# EAGLE design uino-mx250 (EAGLE 7.7.0)
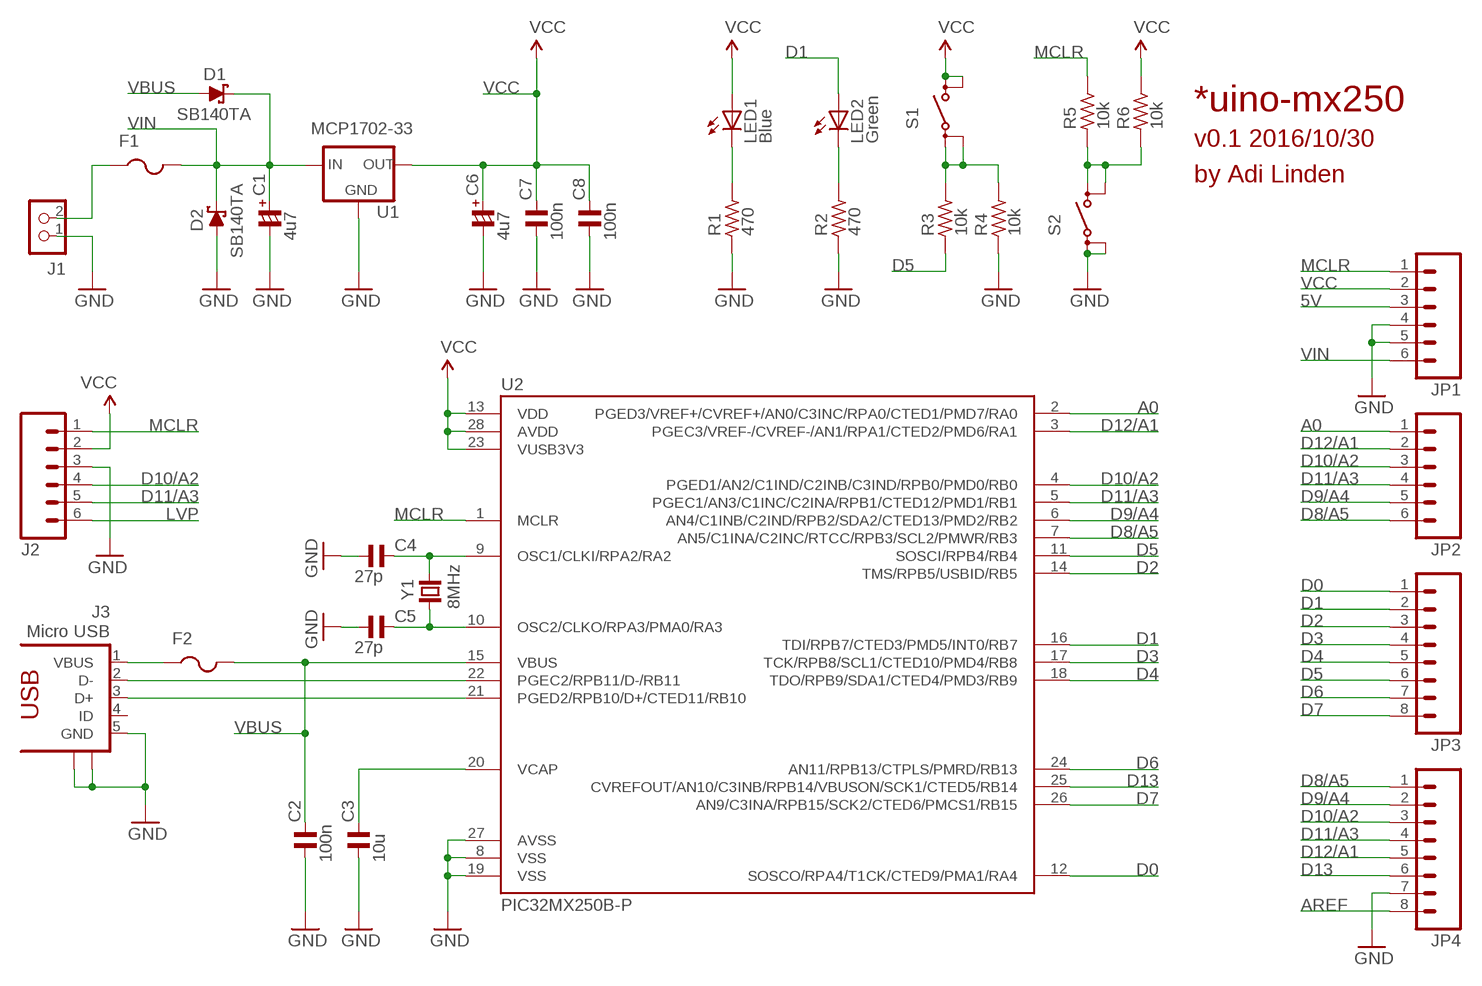
[diagram p0: schematic, sheet 1]

## Parts
C1  4u7  CP_TT025-040  [CTT-025-040]
C2  100n  C_C025-040X018  [C025-040X018]
C3  10u  C_C025-040X018  [C025-040X018]
C4  27p  C_C025-040X018  [C025-040X018]
C5  27p  C_C025-040X018  [C025-040X018]
C6  4u7  CP_TT025-040  [CTT-025-040]
C7  100n  C_C025-040X018  [C025-040X018]
C8  100n  C_C025-040X018  [C025-040X018]
D1  SB140TA  SCHOTTKY-DIODEDO35-7  [DO35-7]
D2  SB140TA  SCHOTTKY-DIODEDO35-7  [DO35-7]
F1  FUSE_PTC-TH  [PTC]
F2  FUSE_PTC-TH  [PTC]
J1  CON_TERMINAL_BLOCK_02-5MM  [TERMINAL_BLOCK_2P_5]
J2  M06LOCK  [1X06_LOCK]
J3  Micro USB  USB_MICRO_B_2.0-TH  [ZX62D-AB-5P8]
JP1  M06SIP  [1X06]
JP2  M06SIP  [1X06]
JP3  M081X08  [1X08]
JP4  M081X08  [1X08]
LED1  Blue  LED3MM  [LED3MM]
LED2  Green  LED3MM  [LED3MM]
R1  470  R_X0207/7  [0207/7]
R2  470  R_X0207/7  [0207/7]
R3  10k  R_X0207/7  [0207/7]
R4  10k  R_X0207/7  [0207/7]
R5  10k  R_X0207/7  [0207/7]
R6  10k  R_X0207/7  [0207/7]
S1  TL1100X  [TL1100X]
S2  TL1100X  [TL1100X]
U1  MCP1702-33  V_REG_MCP170X  [TO-92]
U2  PIC32MX250B-P  [DIL28-3]
Y1  8MHz  CRYTALHC49S  [HC49/S]

## Nets
5V: JP1.3
A0: JP2.1 U2.2(PGED3/VREF+/CVREF+/AN0/C3INC/RPA0/CTED1/PMD7/RA0)
AREF: JP4.8
D0: JP3.1 U2.12(SOSCO/RPA4/T1CK/CTED9/PMA1/RA4)
D1: JP3.2 LED2.A U2.16(TDI/RPB7/CTED3/PMD5/INT0/RB7)
D2: JP3.3 U2.14(TMS/RPB5/USBID/RB5)
D3: JP3.4 U2.17(TCK/RPB8/SCL1/CTED10/PMD4/RB8)
D4: JP3.5 U2.18(TDO/RPB9/SDA1/CTED4/PMD3/RB9)
D5: JP3.6 R3.1 U2.11(SOSCI/RPB4/RB4)
D6: JP3.7 U2.24(AN11/RPB13/CTPLS/PMRD/RB13)
D7: JP3.8 U2.26(AN9/C3INA/RPB15/SCK2/CTED6/PMCS1/RB15)
D8/A5: JP2.6 JP4.1 U2.7(AN5/C1INA/C2INC/RTCC/RPB3/SCL2/PMWR/RB3)
D9/A4: JP2.5 JP4.2 U2.6(AN4/C1INB/C2IND/RPB2/SDA2/CTED13/PMD2/RB2)
D10/A2: J2.4 JP2.3 JP4.3 U2.4(PGED1/AN2/C1IND/C2INB/C3IND/RPB0/PMD0/RB0)
D11/A3: J2.5 JP2.4 JP4.4 U2.5(PGEC1/AN3/C1INC/C2INA/RPB1/CTED12/PMD1/RB1)
D12/A1: JP2.2 JP4.5 U2.3(PGEC3/VREF-/CVREF-/AN1/RPA1/CTED2/PMD6/RA1)
D13: JP4.6 U2.25(CVREFOUT/AN10/C3INB/RPB14/VBUSON/SCK1/CTED5/RB14)
GND: C1.- C2.1 C3.1 C4.1 C5.1 C6.- C7.1 C8.1 D2.A J1.1 J2.3 J3.5(GND) J3.S1 J3.S2 JP1.4 JP1.5 JP4.7 R1.1 R2.1 R4.1 S2.1(P) S2.2(P1) U1.1(GND) U2.8(VSS) U2.19(VSS) U2.27(AVSS)
LVP: J2.6
MCLR: J2.1 JP1.1 R5.2 U2.1(MCLR)
N$2: F1.P$1 J1.2
N$4: F2.P$1 J3.1(VBUS)
N$5: LED1.K(C) R1.2
N$6: LED2.K(C) R2.2
N$8: R3.2 R4.2 S1.1(P) S1.2(P1)
N$10: R5.1 R6.1 S2.3(S) S2.4(S1)
N$13: C3.2 U2.20(VCAP)
N$15: J3.2(D-) U2.22(PGEC2/RPB11/D-/RB11)
N$16: J3.3(D+) U2.21(PGED2/RPB10/D+/CTED11/RB10)
N$24: C4.2 U2.9(OSC1/CLKI/RPA2/RA2) Y1.2
N$25: C5.2 U2.10(OSC2/CLKO/RPA3/PMA0/RA3) Y1.1
VBUS: C2.2 D1.A F2.P$2 U2.15(VBUS)
VCC: C6.+ C7.2 C8.2 J2.2 JP1.2 LED1.A R6.2 S1.3(S) S1.4(S1) U1.3(OUT) U2.13(VDD) U2.23(VUSB3V3) U2.28(AVDD)
VIN: C1.+ D1.C D2.C F1.P$2 JP1.6 U1.2(IN)
Unconnected: J3.4(ID)

## Notes on the sheet
- *uino-mx250
- v0.1 2016/10/30
- by Adi Linden

## Library data of the parts
C1 C6 = rc-master:CP_: POLARIZED CAP
C2-C5 C7 C8 = rc-master:C_: NON-POLARIZED CAP
D1 D2 = diode:SCHOTTKY-DIODE: Schottky Diode
F1 F2 = adi-misc:FUSE_PTC: PTC fuses, resettable thermistors
J1 = adi-misc:CON_TERMINAL_BLOCK_02: 2 poles wire to board terminal block
J2 = SparkFun-Connectors:M06: Header 6 Standard 6-pin 0.1" header. Use with straight break away headers (SKU : PRT-00116), right angle break away headers (PRT-00553), swiss pins (PRT-00743), machine pins (PRT-00117), and female headers (PRT-00115). Molex polarized connector foot print use with SKU : PRT-08094 with associated ...
J3 = adi-misc:USB_MICRO_B_2.0-TH: USB Micro AB OTG Receptacle Hirose ZX62D-AB-5P8 Amphenol FCI 10118194-0001LF
JP1 JP2 = SparkFun:M06: Header 6 Standard 6-pin 0.1" header. Use with straight break away headers (SKU : PRT-00116), right angle break away headers (PRT-00553), swiss pins (PRT-00743), machine pins (PRT-00117), and female headers (PRT-00115). Molex polarized connector foot print use with SKU : PRT-08094 with associated ...
JP3 JP4 = SparkFun:M08: Header 8 Standard 8-pin 0.1" header. Use with straight break away headers (SKU : PRT-00116), right angle break away headers (PRT-00553), swiss pins (PRT-00743), machine pins (PRT-00117), and female headers (PRT-00115).
LED1 LED2 = led:LED: LED OSRAM: - CHIPLED LG R971, LG N971, LY N971, LG Q971, LY Q971, LO R971, LY R971 LH N974, LH R974 LS Q976, LO Q976, LY Q976 LO Q996 - Hyper CHIPLED LW Q18S LB Q993, LB Q99A, LB R99A - SideLED LS A670, LO A670, LY A670, LG A670, LP A670 LB A673, LV A673, LT A673, LW A673 LH A674 LY A675 LS A676, LA A676, LO A676, LY A676, LW A676 LS A679, LY A679, LG A679 - Hyper Micro SIDELED® LS Y876, LA Y876, LO Y876, LY Y876 LT Y87S - SmartLED LW L88C, LW L88S LB L89C, LB L89S, LG L890 LS L89K, LO L89K, LY L89K LS L896, LA L896, LO L896, LY L896 - TOPLED LS T670, LO T670, LY T670, LG T670, LP T670 LSG T670, LSP T670, LSY T670, LOP T670, LYG T670 LG T671, LOG T671, LSG T671 LB T673, LV T673, LT T673, LW T673 LH T674 LS T676, LA T676, LO T676, LY T676, LB T676, LH T676, LSB T676, LW T676 LB T67C, LV T67C, LT T67C, LS T67K, LO T67K, LY T67K, LW E67C LS E67B, LA E67B, LO E67B, LY E67B, LB E67C, LV E67C, LT E67C LW T67C LS T679, LY T679, LG T679 LS T770, LO T770, LY T770, LG T770, LP T770 LB T773, LV T773, LT T773, LW T773 LH T774 LS E675, LA E675, LY E675, LS T675 LS T776, LA T776, LO T776, LY T776, LB T776 LHGB T686 LT T68C, LB T68C - Hyper Mini TOPLED® LB M676 - Mini TOPLED Santana® LG M470 LS M47K, LO M47K, LY M47K Source: http://www.osram.convergy.de LUXEON: - LUMILED® LXK2-PW12-R00, LXK2-PW12-S00, LXK2-PW14-U00, LXK2-PW14-V00 LXK2-PM12-R00, LXK2-PM12-S00, LXK2-PM14-U00 LXK2-PE12-Q00, LXK2-PE12-R00, LXK2-PE12-S00, LXK2-PE14-T00, LXK2-PE14-U00 LXK2-PB12-K00, LXK2-PB12-L00, LXK2-PB12-M00, LXK2-PB14-N00, LXK2-PB14-P00, LXK2-PB14-Q00 LXK2-PR12-L00, LXK2-PR12-M00, LXK2-PR14-Q00, LXK2-PR14-R00 LXK2-PD12-Q00, LXK2-PD12-R00, LXK2-PD12-S00 LXK2-PH12-R00, LXK2-PH12-S00 LXK2-PL12-P00, LXK2-PL12-Q00, LXK2-PL12-R00 Source: www.luxeon.com KINGBRIGHT: KA-3528ASYC Source: www.kingbright.com
R1-R6 = rc-master:R_: RESISTOR
S1 S2 = adi-misc:TL1100X: TACTILE SWITCH
U1 = adi-misc:V_REG_MCP170X
U2 = adi-pic:PIC32MX250B
Y1 = crystal:CRYTAL: CRYSTAL

## Board
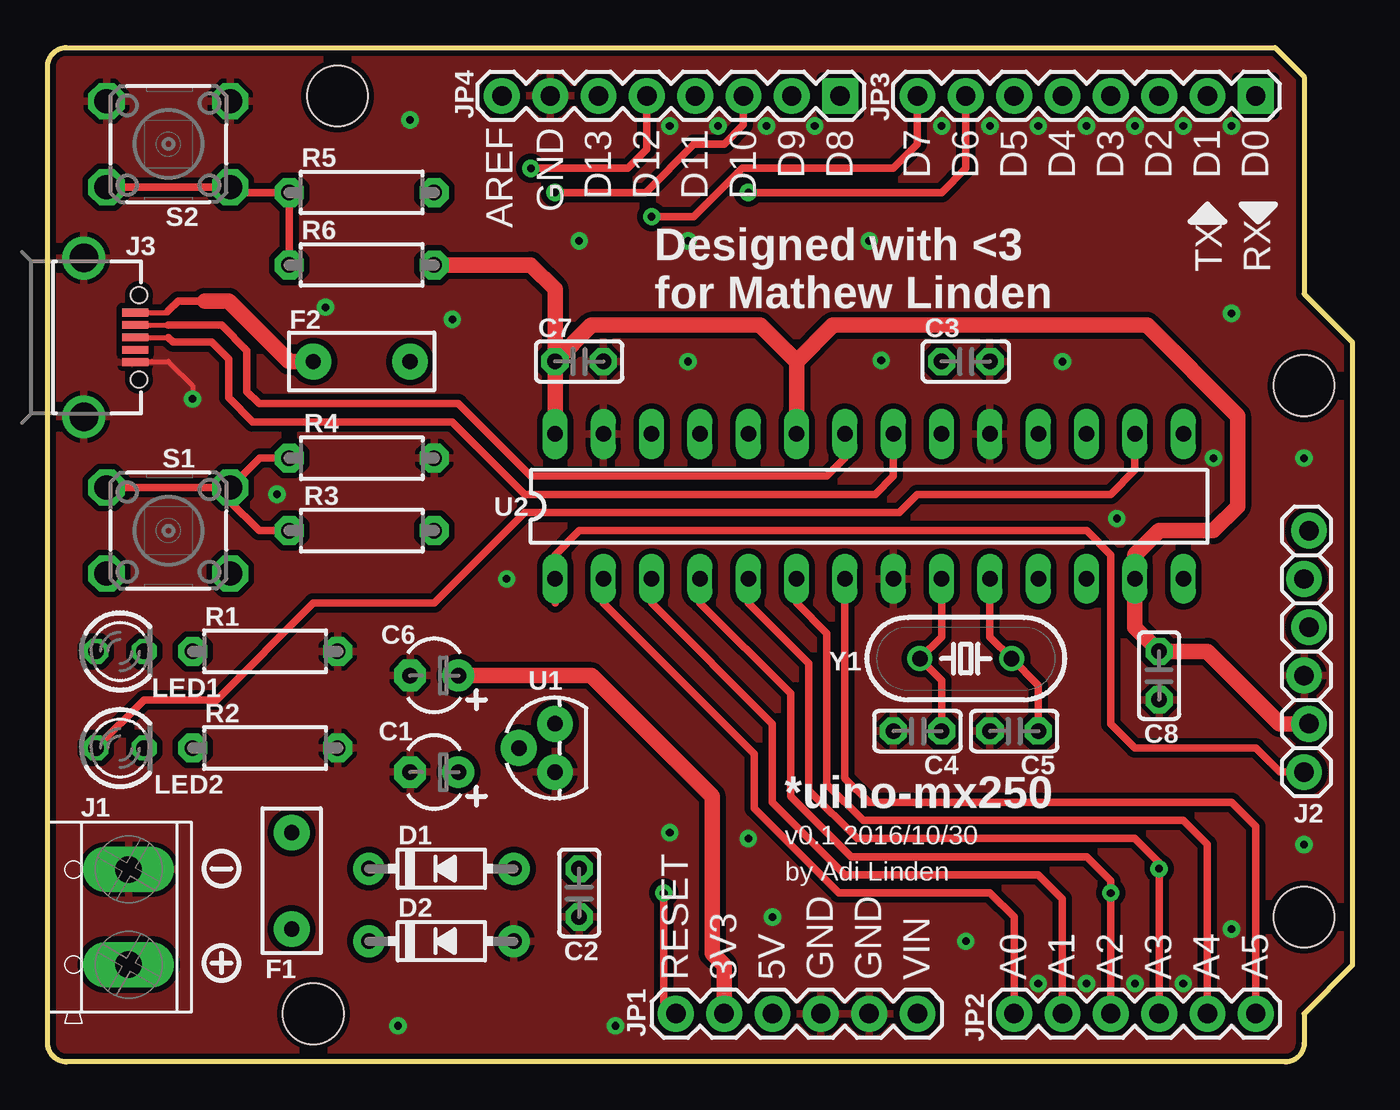
[diagram p1: board, top side]
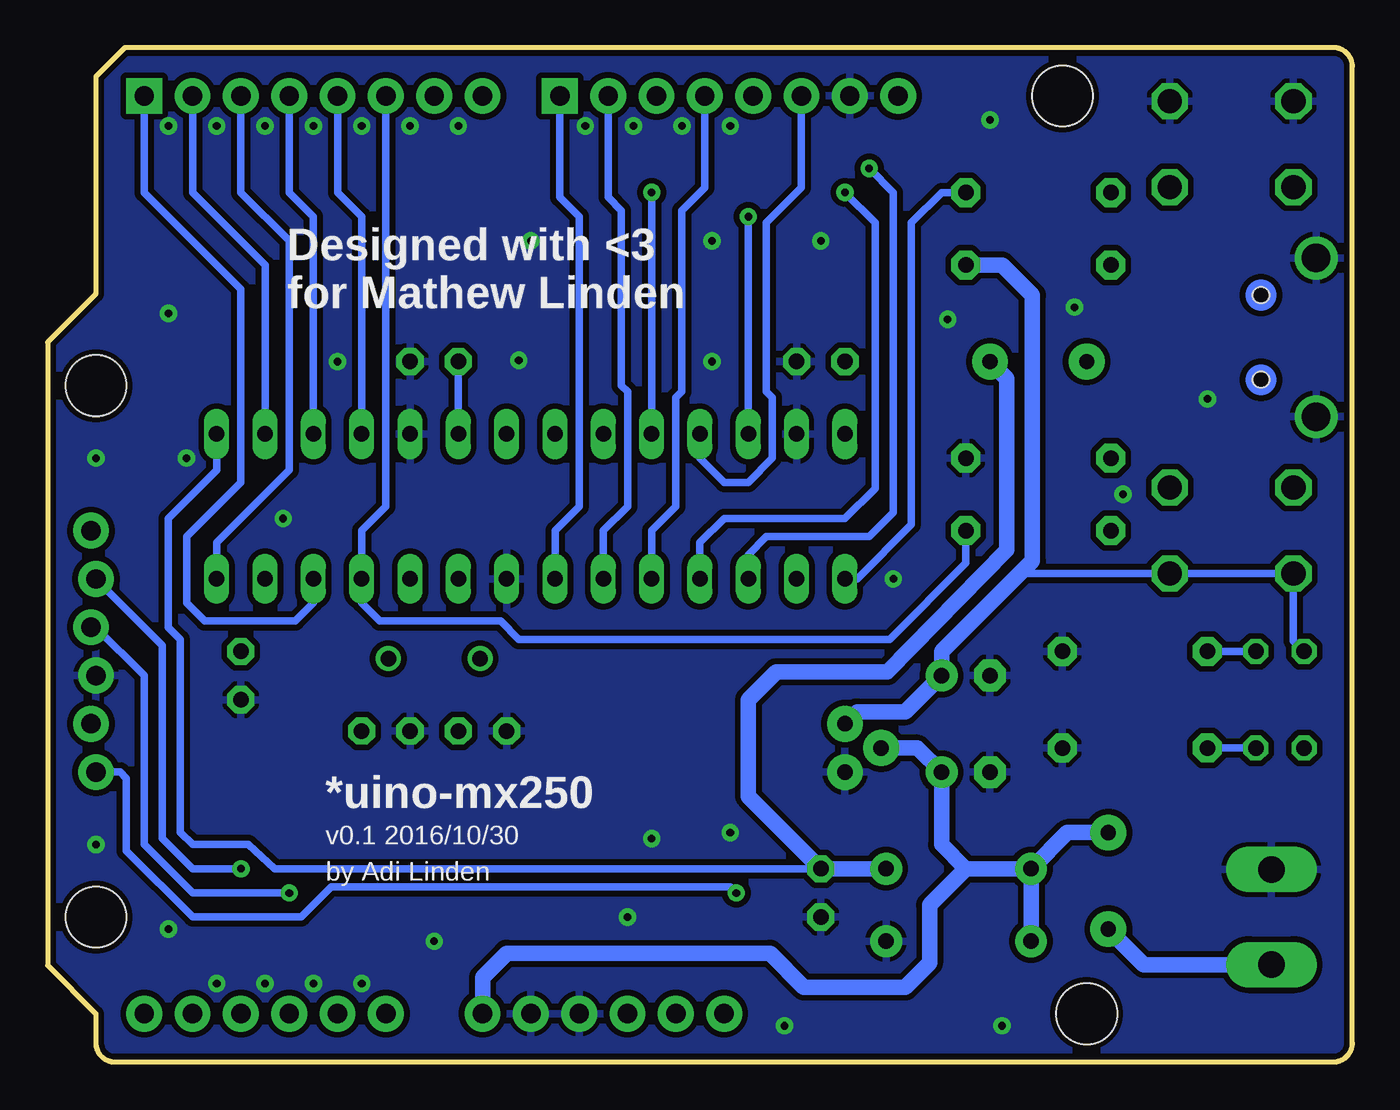
[diagram p2: board, bottom side, seen from below]

Size 68.58 x 53.34 mm. Coordinates in mm from the lower left corner, seen from the top.
Outline: 64.52,53.34 66.04,51.82 66.04,40.39 68.58,37.85 68.58,5.08 66.04,2.54 66.04,1 arc-90 65.04,0 1,0 arc-90 0,1 0,52.34 arc-90 1,53.34 64.52,53.34
Copper layers (1*16): Top 0.035mm / dielectric 1.5mm / Bottom 0.035mm
Design rules "SeeedStudio_2layer_DRU_no_angle_20140221 *": minimum track width 6mil, minimum drill 12mil, track to track 6mil, track to pad 6mil, pad to pad 6mil, via to via 6mil, smd to smd 0mil, copper to edge 10mil, drill to drill 10mil, minimum pad ring 10mil, minimum via ring 10mil, stop-mask expansion 2mil, vias tented up to drill 25mil, thermal gap 10mil
Holes 3.2 mm at 66.04,35.56 66.04,7.62 15.24,50.8 13.97,2.54

### Footprints (pad centres in the part's own frame; a part is rotated, then mirrored left to right if it is on the bottom)
CTT-025-040 = drill 0.813 pad 1.676: + -1.27,0 | drill 0.813 pad 1.676 octagon: - 1.27,0
C025-040X018 = drill 0.813 pad 1.422 octagon: 1 -1.27,0; 2 1.27,0
DO35-7 = drill 0.813 pad 1.676: A 3.81,0; C -3.81,0
PTC = drill 0.8 pad 1.88: P$1 -2.54,0; P$2 2.54,0
TERMINAL_BLOCK_2P_5 = drill 1.4 pad 2.38 long: 1 2.5,-0.45; 2 -2.5,-0.45
1X06_LOCK = drill 1.016 pad 1.88: 1 0,0; 2 2.54,-0.254; 3 5.08,0; 4 7.62,-0.254; 5 10.16,0; 6 12.7,-0.254
ZX62D-AB-5P8 = smd 0.4 x 1.35: 1 -1.3,2.7; 2 -0.65,2.7; 3 0,2.7; 4 0.65,2.7; 5 1.3,2.7 | drill 1.5: S1 -4.175,0; S2 4.175,0 | hole 0.85: -2.225,2.9; 2.225,2.9
1X06 = drill 1.016 pad 1.88: 1 0,0; 2 2.54,0; 3 5.08,0; 4 7.62,0; 5 10.16,0; 6 12.7,0
1X08 = drill 1.016 pad 1.88 square: 1 0,0 | drill 1.016 pad 1.88: 2 2.54,0; 3 5.08,0; 4 7.62,0; 5 10.16,0; 6 12.7,0; 7 15.24,0; 8 17.78,0
LED3MM = drill 0.813 octagon: A -1.27,0; K 1.27,0
0207/7 = drill 0.813 pad 1.524 octagon: 1 -3.81,0; 2 3.81,0
TL1100X = drill 1.27 octagon: 1 -3.251,-2.261; 2 3.251,-2.261; 3 -3.251,2.261; 4 3.251,2.261
TO-92 = drill 0.813 pad 1.88: 1 -1.27,0; 2 0,1.905; 3 1.27,0
DIL28-3 = drill 0.813 long: 1 -16.51,-3.81; 2 -13.97,-3.81; 3 -11.43,-3.81; 4 -8.89,-3.81; 5 -6.35,-3.81; 6 -3.81,-3.81; 7 -1.27,-3.81; 8 1.27,-3.81; 9 3.81,-3.81; 10 6.35,-3.81; 11 8.89,-3.81; 12 11.43,-3.81; 13 13.97,-3.81; 14 16.51,-3.81; 15 16.51,3.81; 16 13.97,3.81; 17 11.43,3.81; 18 8.89,3.81; 19 6.35,3.81; 20 3.81,3.81; 21 1.27,3.81; 22 -1.27,3.81; 23 -3.81,3.81; 24 -6.35,3.81; 25 -8.89,3.81; 26 -11.43,3.81; 27 -13.97,3.81; 28 -16.51,3.81
HC49/S = drill 0.813: 1 -2.413,0; 2 2.413,0

### Placement (x,y rotation side)
C1  20.32,15.24 180 top
C2  27.94,8.89 90 top
C3  48.26,36.83 180 top
C4  45.72,17.4 0 top
C5  50.8,17.4 0 top
C6  20.32,20.32 180 top
C7  27.94,36.83 180 top
C8  58.42,20.32 90 top
D1  20.7,10.16 0 top
D2  20.7,6.35 0 top
F1  12.83,9.53 90 top
F2  16.51,36.83 0 top
J1  3.81,7.62 90 top
J2  66.04,15.24 90 top
J3  1.91,38.1 270 top
JP1  33.02,2.54 0 top
JP2  50.8,2.54 0 top
JP3  63.5,50.8 180 top
JP4  41.66,50.8 180 top
LED1  3.81,21.59 0 top
LED2  3.81,16.51 0 top
R1  11.43,21.59 180 top
R2  11.43,16.51 180 top
R3  16.51,27.94 180 top
R4  16.51,31.75 180 top
R5  16.51,45.72 0 top
R6  16.51,41.91 0 top
S1  6.35,27.94 180 top
S2  6.35,48.26 180 top
U1  26.67,16.51 90 top
U2  43.18,29.21 0 top
Y1  48.26,21.21 180 top

### Tracks (layer width: path | path; a pad name or v marks a point on that pad's centre or on a via)
A0
  Top 0.406: JP2.1 50.8,7.62 49.53,8.89 41.59,8.89 37.15,13.34 37.15,16.19 29.21,24.13 U2.2
D0
  Bottom 0.406: JP3.1 63.5,45.72 58.42,40.64 58.42,30.48 61.28,27.62 61.28,24.13 60.33,23.18 55.56,23.18 54.61,24.13 U2.12
D1
  Top 0.406: U2.16 57.15,31.11 55.88,29.84 45.72,29.84 44.77,28.89 25.08,28.89 20.32,24.13 13.97,24.13 8.89,19.05 5.08,19.05 LED2.A
  Bottom 0.406: JP3.2 60.96,45.72 57.15,41.91 U2.16
D2
  Bottom 0.406: JP3.3 58.42,45.72 55.88,43.18 55.88,31.11 59.69,27.3 U2.14
D3
  Bottom 0.406: JP3.4 55.88,45.72 54.61,44.45 U2.17
D4
  Bottom 0.406: JP3.5 53.34,45.72 52.07,44.45 U2.18
D5
  Bottom 0.406: JP3.6 50.8,29.21 52.07,27.94 U2.11 52.07,24.13 51.12,23.18 44.77,23.18 43.81,22.23 24.32,22.23 20.32,26.23 R3.1
D6  (via drill 0.4)
  Top 0.406: JP3.7 48.26,46.99 46.99,45.72 v36.83,45.72
  Bottom 0.406: v36.83,45.72 U2.24
D7  (via drill 0.4)
  Top 0.406: v31.75,44.45 33.97,44.45 36.51,46.99 44.45,46.99 45.72,48.26 JP3.8
  Bottom 0.406: v31.75,44.45 U2.26
D8/A5
  Top 0.406: U2.7 41.91,14.92 43.18,13.65 62.23,13.65 63.5,12.38 JP2.6
  Bottom 0.406: JP4.1 41.66,45.47 40.64,44.45 40.64,29.21 41.91,27.94 U2.7
D9/A4
  Top 0.406: JP2.5 60.96,11.43 59.69,12.7 42.86,12.7 40.96,14.61 40.96,22.54 39.37,24.13 U2.6
  Bottom 0.406: JP4.2 39.12,45.47 38.42,44.77 38.42,35.56 38.1,35.24 38.1,29.21 39.37,27.94 U2.6
D10/A2  (via drill 0.4)
  Top 0.406: JP2.3 v55.88,8.89 55.88,9.53 54.61,10.79 42.23,10.79 39.05,13.97 39.05,19.37 34.29,24.13 U2.4 | v26.67,45.72 31.43,45.72 33.97,48.26 35.56,48.26 36.58,49.28 JP4.3
  Bottom 0.406: U2.4 34.29,27.3 33.02,28.57 26.67,28.57 25.08,30.16 25.08,44.13 v26.67,45.72 | J2.4 66.04,22.86 63.5,20.32 63.5,11.43 60.96,8.89 v55.88,8.89
D11/A3  (via drill 0.4)
  Top 0.406: JP2.4 v58.42,10.16 58.42,10.48 57.15,11.75 42.55,11.75 40.01,14.29 40.01,20.95 36.83,24.13 U2.5
  Bottom 0.406: JP4.4 34.04,45.97 35.24,44.77 35.24,35.24 35.56,34.92 35.56,29.21 36.83,27.94 U2.5 | J2.5 62.55,21.91 62.55,11.75 60.96,10.16 v58.42,10.16
D12/A1  (via drill 0.4)
  Top 0.406: JP4.5 31.5,48.01 30.48,46.99 v25.4,46.99 | JP2.2 53.34,8.57 52.07,9.84 41.91,9.84 38.1,13.65 38.1,17.78 31.75,24.13 U2.3
  Bottom 0.406: v25.4,46.99 24.13,45.72 24.13,28.89 25.4,27.62 30.8,27.62 31.75,26.67 U2.3
D13
  Bottom 0.406: JP4.6 28.96,45.97 30.8,44.13 30.8,35.24 30.48,34.92 30.48,31.75 31.75,30.48 33.02,30.48 34.29,31.75 U2.25
GND  (via drill 0.4)
  Top 0.254: J3.5 4.63,36.83 6.35,36.83 7.62,35.56 v7.62,34.86
  other vias: 33.66,43.18 40.32,49.21 32.7,49.21 35.24,49.21 37.78,49.21 43.18,43.18 61.28,31.75 56.2,28.57 62.23,39.37 66.04,11.43 62.23,6.99 59.69,4.13 57.15,4.13 54.61,4.13 52.07,4.13 48.26,6.35 38.1,7.62 29.84,1.91 52.07,49.21 57.15,49.21 59.69,49.21 62.23,49.21 27.94,43.18 19.05,49.53 21.27,39.05 36.83,11.75 12.06,29.84 14.61,39.69 33.66,36.83 43.81,36.89 53.34,36.83 54.61,49.21 49.53,49.21 46.99,49.21 24.13,25.4 18.41,1.91 66.04,31.75 32.7,12.06
  pour Top (isolate 0.305): 0,53.34 68.58,53.34 68.58,0 0,0
  pour Bottom (isolate 0.305): 0,53.34 68.58,53.34 68.58,0 0,0
MCLR  (via drill 0.4)
  Top 0.406: 26.67,24.13 U2.1 26.67,26.67 27.94,27.94 54.61,27.94 55.88,26.67 55.88,17.78 57.15,16.51 63.5,16.51 64.77,15.24 J2.1 | v32.38,8.89 32.38,3.17 JP1.1
  Bottom 0.406: R5.2 21.59,45.72 23.18,44.13 23.18,28.26 26.04,25.4 U2.1 | v32.38,8.89 32.7,9.21 53.66,9.21 55.24,7.62 60.96,7.62 64.45,11.11 64.45,14.92 64.77,15.24 J2.1
N$2
  Bottom 0.813: J1.2 10.96,5.12 F1.P$1
N$4
  Top 0.254: J3.1 6.32,39.4 6.35,39.5
  Top 0.406: 6.35,39.5 6.86,40.01 8.26,40.01
  Top 0.813: 8.26,40.01 9.53,40.01 12.7,36.83 F2.P$1
N$5
  Bottom 0.406: LED1.K R1.2
N$6
  Bottom 0.406: LED2.K R2.2
N$8
  Top 0.406: S1.2 S1.1 | R4.2 11.15,31.75 S1.1 | R3.2 11.11,27.94 9.53,29.53 9.53,30.12 S1.1
N$10
  Top 0.406: R6.1 R5.1 9.88,45.72 S2.3 S2.4
N$13
  Bottom 0.406: C3.2 U2.20
N$15
  Top 0.254: J3.2 6.33,38.75 6.35,38.73
  Top 0.406: U2.22 41.91,31.75 40.96,30.8 25.4,30.8 21.59,34.61 11.11,34.61 10.48,35.24 10.48,37.4 9.14,38.73 6.35,38.73
N$16
  Top 0.254: J3.3 6.35,38.1
  Top 0.406: U2.21 44.45,30.8 43.5,29.84 25.08,29.84 21.27,33.66 10.79,33.66 9.53,34.92 9.53,36.96 8.64,37.85 6.6,37.85 6.35,38.1
N$24
  Top 0.406: U2.9 46.99,22.35 Y1.2 46.99,20.07 C4.2
N$25
  Top 0.406: U2.10 49.53,22.35 Y1.1 52.07,19.81 C5.2
VBUS
  Bottom 0.406: U2.15 59.69,31.11 62.23,28.57 62.23,22.86 61.59,22.23 61.59,12.06 60.96,11.43 58.04,11.43 56.64,10.16 C2.2
  Bottom 0.813: F2.P$2 18.16,35.94 18.16,26.92 24.45,20.51 30.29,20.51 31.75,19.05 31.75,13.97 C2.2 D1.A
VCC
  Top 0.813: J2.2 64.77,17.78 60.96,21.59 C8.2 57.15,22.86 U2.13 57.15,26.67 58.42,27.94 61.28,27.94 62.55,29.21 62.55,33.97 57.78,38.73 41.27,38.73 39.37,36.83 | C7.2 U2.28 26.67,33.97 | 39.37,34.29 U2.23 39.37,36.83 | R6.2 25.4,41.91 26.67,40.64 C7.2 | JP1.2 35.56,5.08 34.92,5.71 34.92,13.97 28.57,20.32 C6.+ | C7.2 28.57,38.73 37.47,38.73 39.37,36.83
  Bottom 0.406: 17.78,25.4 17.5,25.68 S1.3 S1.4 3.1,22.15 LED1.A
  Bottom 0.813: R6.2 18.41,41.91 16.83,40.32 16.83,26.35 17.78,25.4 21.59,21.59 C6.+ 23.5,18.41 26.04,18.41 U1.3
VIN
  Bottom 0.813: D1.C D2.C | 20.32,10.16 21.59,11.43 C1.+ 22.86,16.51 U1.2 | 20.32,10.16 D1.C | JP1.6 45.72,4.45 44.45,5.71 30.61,5.71 28.83,3.94 23.5,3.94 22.23,5.21 22.23,8.26 20.32,10.16 | F1.P$2 14.99,12.06 D1.C

### Text on the board
tPlace: AREF | GND | D13 | D12 | D11 | D10 | D9 | D8 | D7 | D6 | D5 | D4 | D3 | D2 | D1 | D0 | TX | RX | Designed with <3 / for Mathew Linden | *uino-mx250 | v0.1 2016/10/30 | by Adi Linden | RESET | 3V3 | 5V | GND | GND | VIN | A0 | A1 | A2 | A3 | A4 | A5
bPlace: Designed with <3 / for Mathew Linden | *uino-mx250 | v0.1 2016/10/30 | by Adi Linden